# EAGLE design Power PCB (EAGLE 9.6.2)
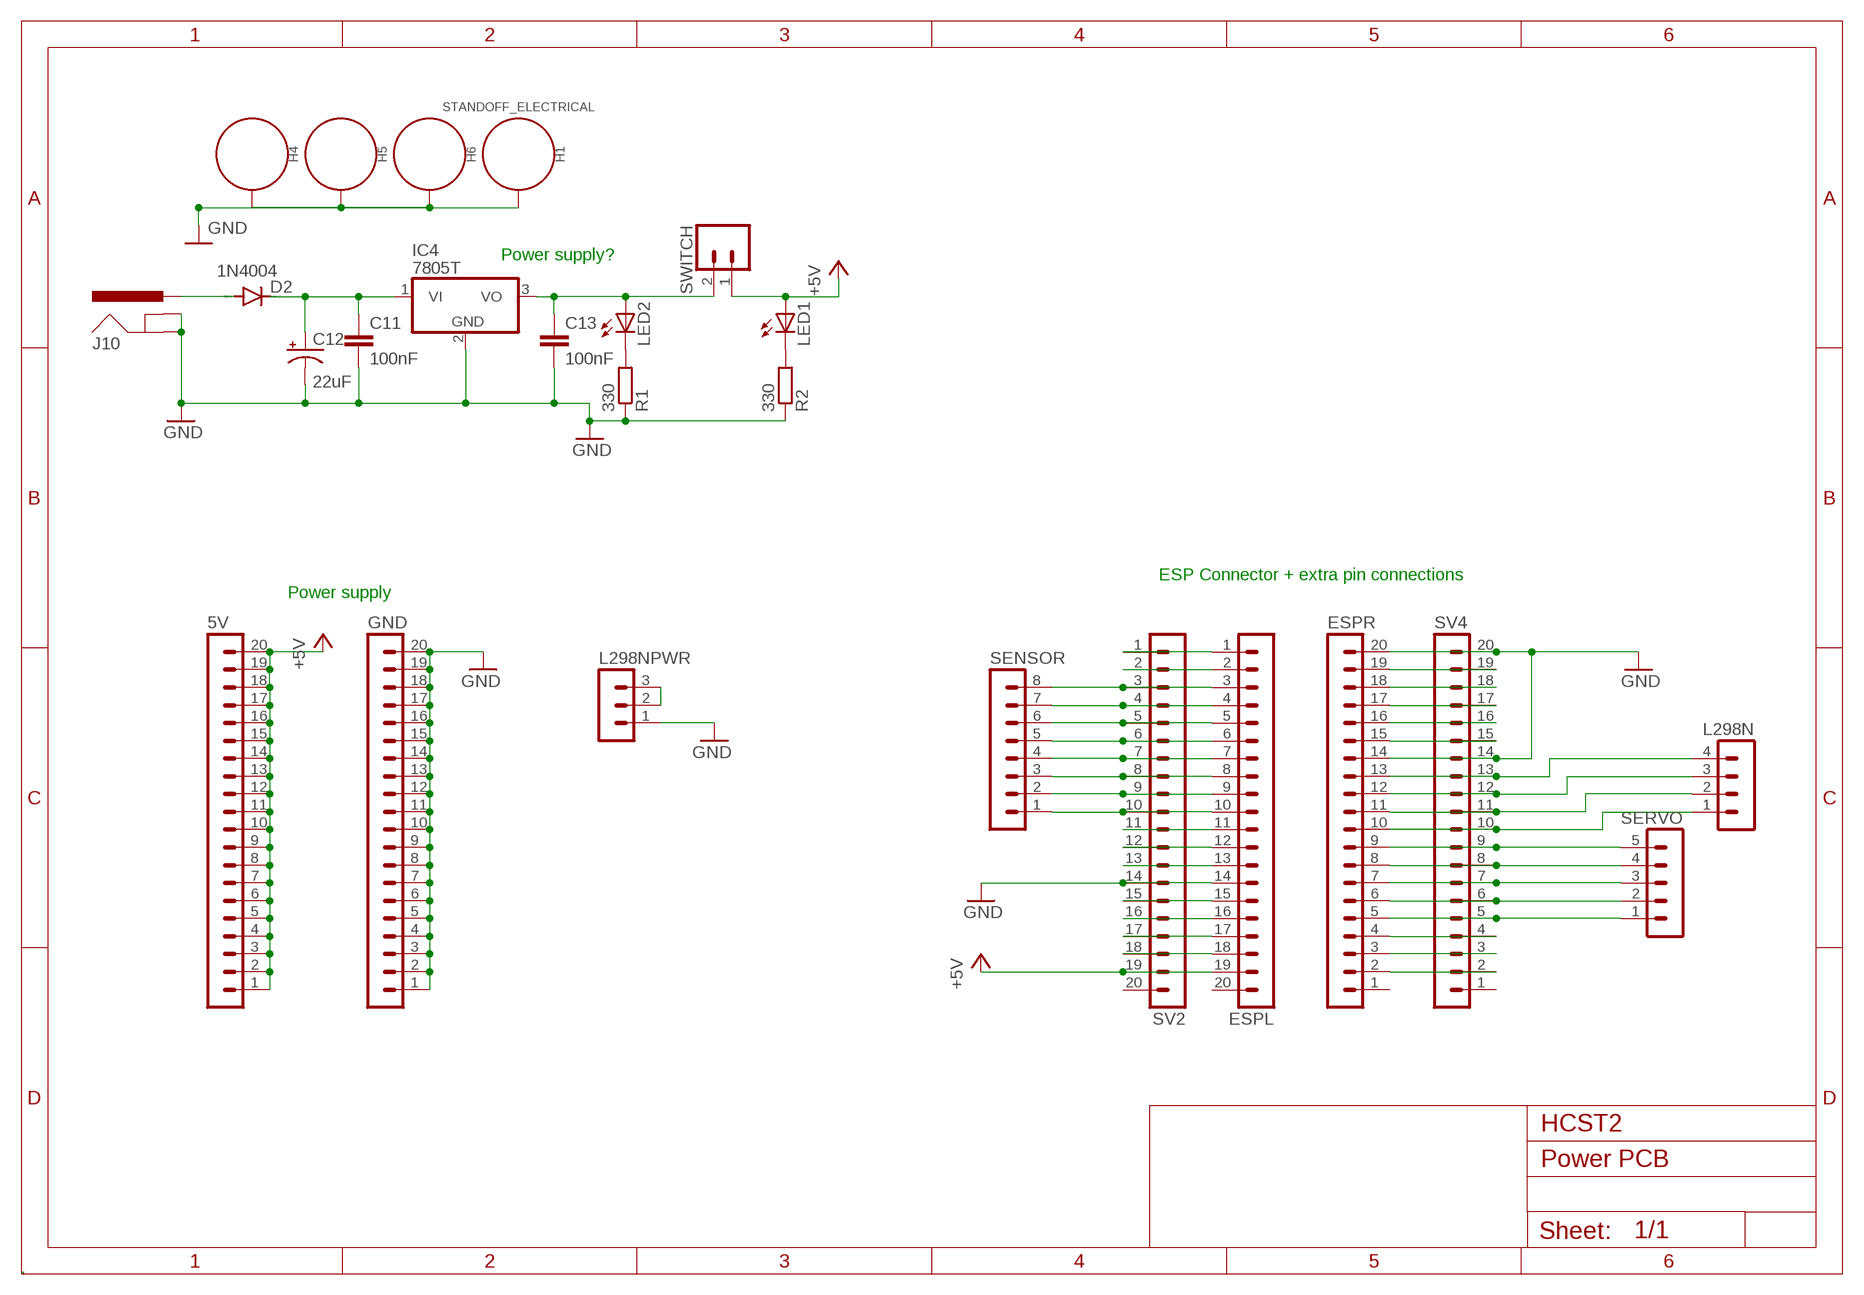
[diagram p0: schematic, sheet 1]

## Parts
5V  MA20-1  [MA20-1]
C11  100nF  C2.5/2  [C2.5-2]
C12  22uF  CPOL-USE2.5-7  [E2,5-7]
C13  100nF  C2.5/2  [C2.5-2]
D2  1N4004  [DO41-10]
ESPL  MA20-1  [MA20-1]
ESPR  MA20-1  [MA20-1]
GND  MA20-1  [MA20-1]
H1  STANDOFF_ELECTRICAL  [STANDOFF-ELECTRICAL]
H4  STANDOFF_ELECTRICAL  [STANDOFF-ELECTRICAL]
H5  STANDOFF_ELECTRICAL  [STANDOFF-ELECTRICAL]
H6  STANDOFF_ELECTRICAL  [STANDOFF-ELECTRICAL]
IC4  7805T  [TO220H]
J10  EL311-ROBOT_SPARKFUN-CONNECTORS_POWER_JACKPTH  [EL311-ROBOT_SPARKFUN-CONNECTORS_POWER_JACK_PTH]
L298N  MA04-1  [MA04-1]
L298NPWR  MA03-1  [MA03-1]
LED1  LED3MM  [LED3MM]
LED2  LED3MM  [LED3MM]
R1  330  R-EU_0207/10  [0207/10]
R2  330  R-EU_0207/10  [0207/10]
SENSOR  MA08-1  [MA08-1]
SERVO  MA05-1  [MA05-1]
SV2  MA20-1  [MA20-1]
SV4  MA20-1  [MA20-1]
SWITCH  CONN_02  [1X02]

## Nets
+5V [power]: 5V.1 5V.2 5V.3 5V.4 5V.5 5V.6 5V.7 5V.8 5V.9 5V.10 5V.11 5V.12 5V.13 5V.14 5V.15 5V.16 5V.17 5V.18 5V.19 5V.20 ESPL.19 LED1.A SV2.19 SWITCH.1
GND [power]: C11.2 C12.- C13.2 ESPL.14 ESPR.14 ESPR.20 GND.1 GND.2 GND.3 GND.4 GND.5 GND.6 GND.7 GND.8 GND.9 GND.10 GND.11 GND.12 GND.13 GND.14 GND.15 GND.16 GND.17 GND.18 GND.19 GND.20 H1.P1 H4.P1 H5.P1 H6.P1 IC4.2(GND) J10.GND J10.GNDBREAK L298NPWR.1 R1.1 R2.1 SV2.14 SV4.14 SV4.20
N$1: ESPR.10 L298N.1 SV4.10
N$2: ESPR.9 SERVO.5 SV4.9
N$3: ESPR.8 SERVO.4 SV4.8
N$4: ESPR.7 SERVO.3 SV4.7
N$5: ESPR.6 SERVO.2 SV4.6
N$6: ESPR.5 SERVO.1 SV4.5
N$7: ESPR.11 L298N.2 SV4.11
N$8: ESPR.12 L298N.3 SV4.12
N$9: ESPR.13 L298N.4 SV4.13
N$10: ESPR.19 SV4.19
N$11: ESPR.18 SV4.18
N$12: ESPR.17 SV4.17
N$13: ESPR.16 SV4.16
N$14: ESPR.15 SV4.15
N$15: ESPR.4 SV4.4
N$16: ESPR.3 SV4.3
N$17: ESPR.2 SV4.2
N$18: ESPL.18 SV2.18
N$19: ESPL.17 SV2.17
N$20: ESPL.16 SV2.16
N$21: ESPL.15 SV2.15
N$22: ESPL.13 SV2.13
N$23: ESPL.12 SV2.12
N$24: ESPL.11 SV2.11
N$25: ESPL.10 SENSOR.1 SV2.10
N$26: ESPL.9 SENSOR.2 SV2.9
N$27: ESPL.8 SENSOR.3 SV2.8
N$28: ESPL.7 SENSOR.4 SV2.7
N$29: ESPL.1 SV2.1
N$30: ESPL.2 SV2.2
N$31: ESPL.3 SENSOR.8 SV2.3
N$32: ESPL.4 SENSOR.7 SV2.4
N$33: ESPL.5 SENSOR.6 SV2.5
N$34: ESPL.6 SENSOR.5 SV2.6
N$35 [power]: C13.1 IC4.3(VO) LED2.A SWITCH.2
N$36 [power]: L298NPWR.2 L298NPWR.3
N$38: LED2.K(C) R1.2
N$39: LED1.K(C) R2.2
PWR3 [power]: D2.A J10.PWR
PWR4 [power]: C11.1 C12.+ D2.C IC4.1(VI)
Unconnected: ESPL.20 ESPR.1 SV2.20 SV4.1

## Notes on the sheet
- Power supply?
- ESP Connector + extra pin connections
- Power supply
- HCST2
- .

## Library data of the parts
5V ESPL ESPR GND SV2 SV4 = con-lstb:MA20-1: PIN HEADER; OC_FARNELL: unknown; OC_NEWARK: unknown
C11 C13 = capacitor-wima:C: CAPACITOR naming: grid - package width
C12 = adafruit:CPOL-US: POLARIZED CAPACITOR, American symbol
D2 = diode:1N4004: DIODE general purpose rectifier, 1 A
H1 = EL311 2021:STANDOFF_ELECTRICAL: Stand Off Drill holes with an electrical connection. For example, use these to ground your board to a chassis. Example SparkFun Products Screw - Phillips Head (1/4", 4-40, 10 pack) <https://www.sparkfun.com/products/10453> (PRT-10453) Screw - Phillips Head (1/2", 4-40, 10 pack) <https://www.sparkfun.com/products/10452> (PRT-10452) Screw - Phillips Head (3/4", 4-40, 10 pack) <https://www.sparkfun.com/products/10451> (PRT-10451) Screw - Phillips Head (1", 4-40, 10 pack) <https://www.sparkfun.com/products/10450> (PRT-10450)
H4-H6 = SparkFun-Hardware:STANDOFF_ELECTRICAL: Stand Off Drill holes with an electrical connection. For example, use these to ground your board to a chassis. Example SparkFun Products Screw - Phillips Head (1/4", 4-40, 10 pack) <https://www.sparkfun.com/products/10453> (PRT-10453) Screw - Phillips Head (1/2", 4-40, 10 pack) <https://www.sparkfun.com/products/10452> (PRT-10452) Screw - Phillips Head (3/4", 4-40, 10 pack) <https://www.sparkfun.com/products/10451> (PRT-10451) Screw - Phillips Head (1", 4-40, 10 pack) <https://www.sparkfun.com/products/10450> (PRT-10450)
IC4 = adafruit:78*: Positive VOLTAGE REGULATOR Added bigger pads to the TO-92 package
J10 = EL311_2017_18:EL311-ROBOT_SPARKFUN-CONNECTORS_POWER_JACK: Power Jack This is the standard 5.5mm barrel jack for power. The PTH is the most common, proven, reliable, footprint. The Slot footprint only works if the mill layer is transmitted to the PCB fab house so be warned. Mating wall wart : TOL-00298 (and others); PROD_ID: PRT-00119
L298N = con-lstb:MA04-1: PIN HEADER; OC_FARNELL: unknown; OC_NEWARK: unknown
L298NPWR = con-lstb:MA03-1: PIN HEADER; OC_FARNELL: unknown; OC_NEWARK: unknown
LED1 LED2 = EL311 2021:LED: LED OSRAM: - CHIPLED LG R971, LG N971, LY N971, LG Q971, LY Q971, LO R971, LY R971 LH N974, LH R974 LS Q976, LO Q976, LY Q976 LO Q996 - Hyper CHIPLED LW Q18S LB Q993, LB Q99A, LB R99A - SideLED LS A670, LO A670, LY A670, LG A670, LP A670 LB A673, LV A673, LT A673, LW A673 LH A674 LY A675 LS A676, LA A676, LO A676, LY A676, LW A676 LS A679, LY A679, LG A679 - Hyper Micro SIDELED® LS Y876, LA Y876, LO Y876, LY Y876 LT Y87S - SmartLED LW L88C, LW L88S LB L89C, LB L89S, LG L890 LS L89K, LO L89K, LY L89K LS L896, LA L896, LO L896, LY L896 - TOPLED LS T670, LO T670, LY T670, LG T670, LP T670 LSG T670, LSP T670, LSY T670, LOP T670, LYG T670 LG T671, LOG T671, LSG T671 LB T673, LV T673, LT T673, LW T673 LH T674 LS T676, LA T676, LO T676, LY T676, LB T676, LH T676, LSB T676, LW T676 LB T67C, LV T67C, LT T67C, LS T67K, LO T67K, LY T67K, LW E67C LS E67B, LA E67B, LO E67B, LY E67B, LB E67C, LV E67C, LT E67C LW T67C LS T679, LY T679, LG T679 LS T770, LO T770, LY T770, LG T770, LP T770 LB T773, LV T773, LT T773, LW T773 LH T774 LS E675, LA E675, LY E675, LS T675 LS T776, LA T776, LO T776, LY T776, LB T776 LHGB T686 LT T68C, LB T68C - Hyper Mini TOPLED® LB M676 - Mini TOPLED Santana® LG M470 LS M47K, LO M47K, LY M47K Source: http://www.osram.convergy.de/
R1 R2 = EL311 2021:R-EU_: RESISTOR, European symbol
SENSOR = con-lstb:MA08-1: PIN HEADER; OC_FARNELL: unknown; OC_NEWARK: unknown
SERVO = con-lstb:MA05-1: PIN HEADER; OC_FARNELL: unknown; OC_NEWARK: unknown
SWITCH = EL311 2021:CONN_02: Multi connection point. Often used as Generic Header-pin footprint for 0.1 inch spaced/style header connections On any of the 0.1 inch spaced packages, you can populate with these: Break Away Headers - Straight <https://www.sparkfun.com/products/116> (PRT-00116) Break Away Male Headers - Right Angle <https://www.sparkfun.com/products/553> (PRT-00553) Female Headers <https://www.sparkfun.com/products/115> (PRT-00115) Break Away Headers - Machine Pin <https://www.sparkfun.com/products/117> (PRT-00117) Break Away Female Headers - Swiss Machine Pin <https://www.sparkfun.com/products/743> (PRT-00743) For SCREWTERMINALS and SPRING TERMINALS visit here: Screw Terimnals on SparkFun.com <https://www.sparkfun.com/search/results?term=Screw+Terminals> (5mm/3.5mm/2.54mm spacing) This device is also useful as a general connection point to wire up your design to another part of your project. Our various solder wires solder well into these plated through hole pads. Hook-Up Wire - Assortment (Stranded, 22 AWG) <https://www.sparkfun.com/products/11375> (PRT-11375) Hook-Up Wire - Assortment (Solid Core, 22 AWG) <https://www.sparkfun.com/products/11367> (PRT-11367) View the entire wire category on our website here <https://www.sparkfun.com/categories/141> Special notes: Molex polarized connector foot print use with: PRT-08233 with associated crimp pins and housings. 2.54_SCREWTERM for use with PRT-10571. 3.5mm Screw Terminal footprints for PRT-08084 5mm Screw Terminal footprints for use with PRT-08432; PROD_ID: CONN-13512; SF_ID: PRT-09918; SF_SKU: PRT-08432; SKU: PRT-09914

## Net classes
0 default: width 0.406 mm, drill 0.406 mm, clearance 0.406 mm
1 power: width 0.635 mm, drill 0.406 mm, clearance 0.406 mm
2 Power2: width 1.397 mm, drill 0.406 mm, clearance 0.406 mm

## Board
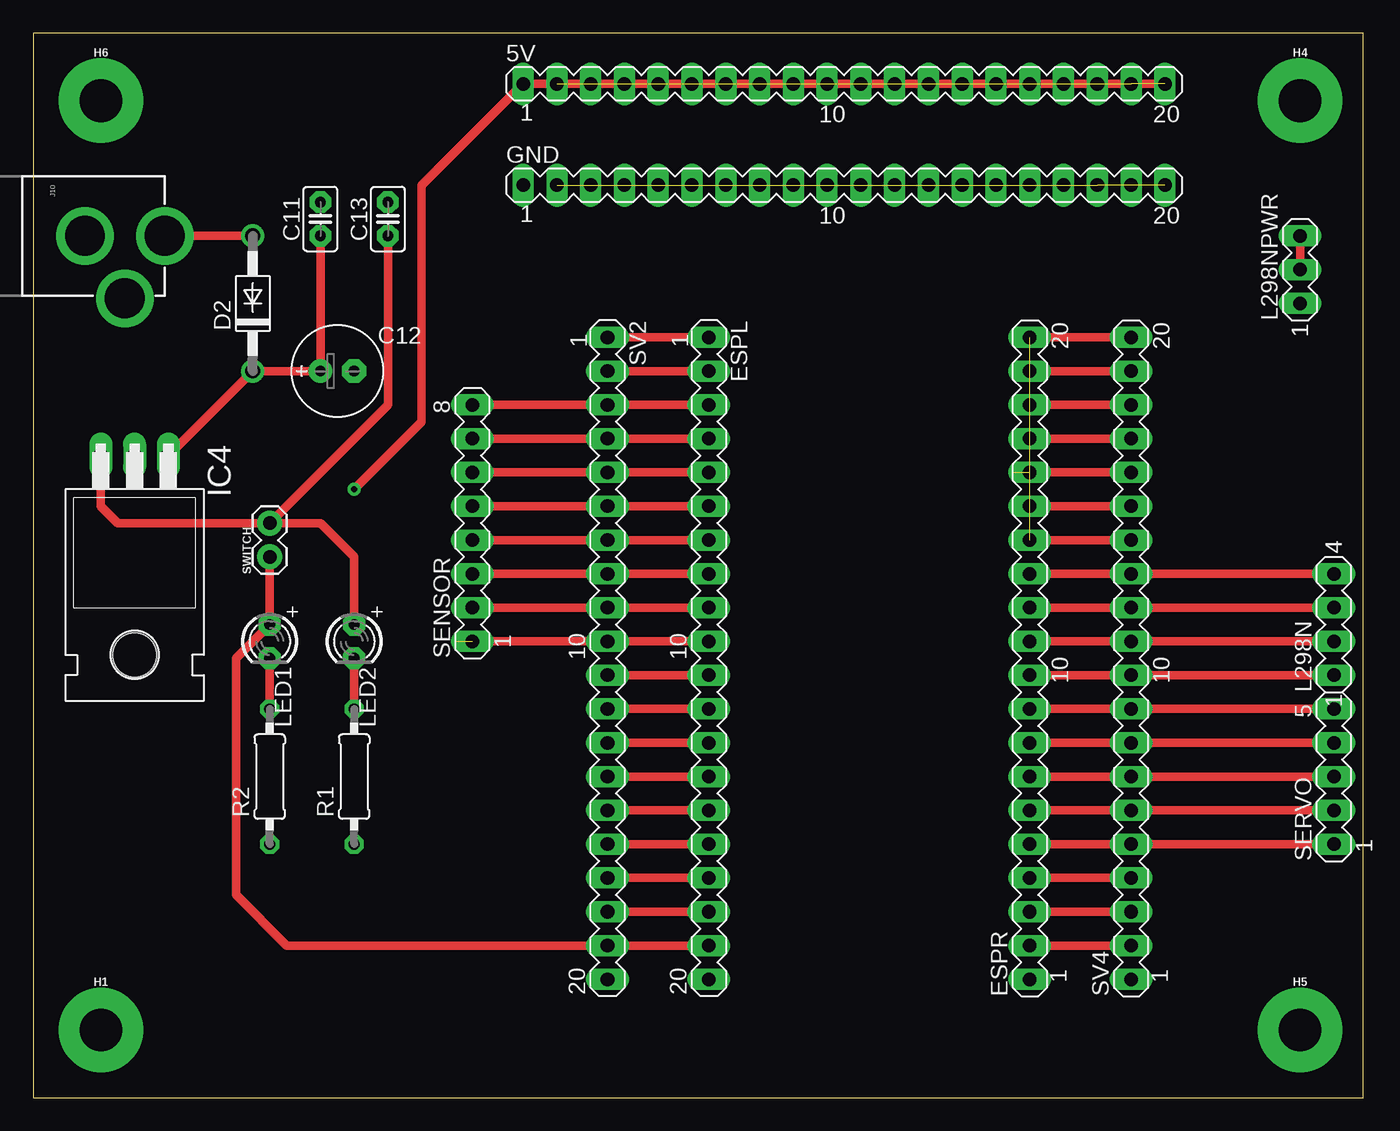
[diagram p1: board, top side]
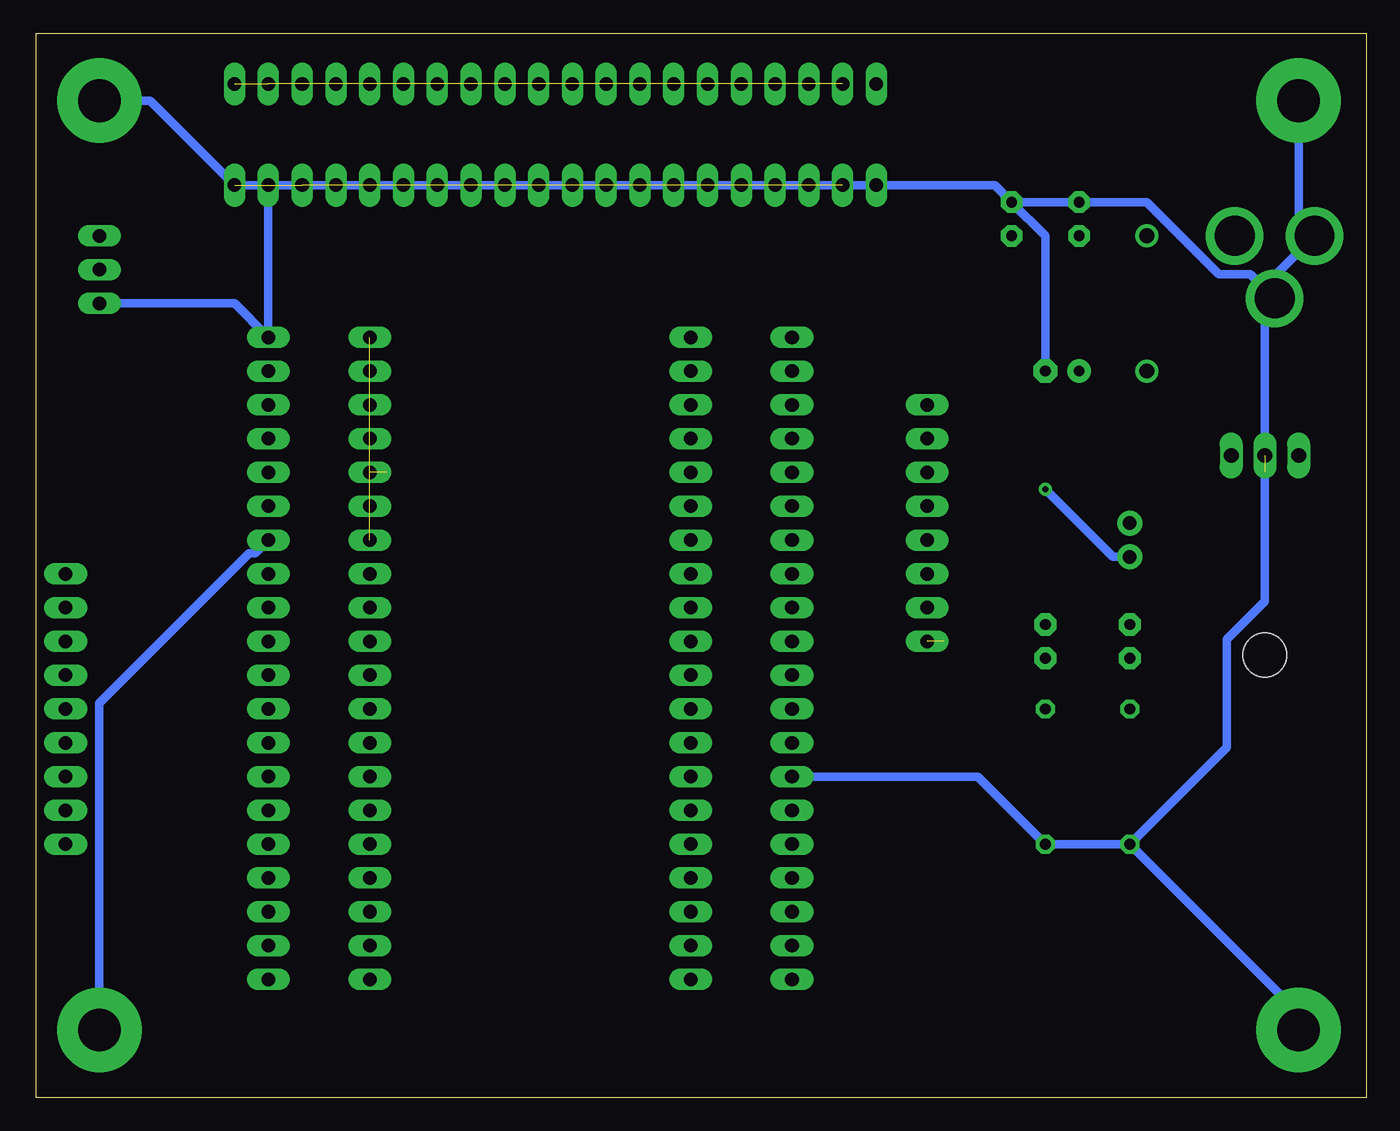
[diagram p2: board, bottom side, seen from below]

Size 100 x 80 mm. Coordinates in mm from the lower left corner, seen from the top.
Outline: 0,0 100,0 100,80 0,80 0,0
Copper layers (1*16): Top 0.035mm / dielectric 1.5mm / Bottom 0.035mm
Design rules "EL311_DRC_2020": minimum track width 12mil, minimum drill 18mil, track to track 12mil, track to pad 12mil, pad to pad 12mil, via to via 12mil, smd to smd 12mil, copper to edge 12mil, drill to drill 15mil, minimum pad ring 12mil, minimum via ring 10mil, stop-mask expansion 4mil, vias tented up to drill 25mil, thermal gap 10mil

### Footprints (pad centres in the part's own frame; a part is rotated, then mirrored left to right if it is on the bottom)
MA20-1 = drill 1.016 long: 1 -24.13,0; 2 -21.59,0; 3 -19.05,0; 4 -16.51,0; 5 -13.97,0; 6 -11.43,0; 7 -8.89,0; 8 -6.35,0; 9 -3.81,0; 10 -1.27,0; 11 1.27,0; 12 3.81,0; 13 6.35,0; 14 8.89,0; 15 11.43,0; 16 13.97,0; 17 16.51,0; 18 19.05,0; 19 21.59,0; 20 24.13,0
C2.5-2 = drill 0.813 pad 1.6 octagon: 1 -1.27,0; 2 1.27,0
E2,5-7 = drill 0.813 pad 1.778: + -1.27,0 | drill 0.813 pad 1.778 octagon: - 1.27,0
DO41-10 = drill 1.118: A 5.08,0; C -5.08,0
STANDOFF-ELECTRICAL = drill 3.2 pad 6.35: P1 0,0
TO220H = drill 1.118 long: 1 -2.54,-10.16; 2 0,-10.16; 3 2.54,-10.16 | hole 3.302: 0,4.826
EL311-ROBOT_SPARKFUN-CONNECTORS_POWER_JACK_PTH = drill 2.997 pad 4.318: GND 0,7.7; GNDBREAK 4.7,10.7; PWR 0,13.7
MA04-1 = drill 1.016 long: 1 -3.81,0; 2 -1.27,0; 3 1.27,0; 4 3.81,0
MA03-1 = drill 1.016 long: 1 -2.54,0; 2 0,0; 3 2.54,0
LED3MM = drill 0.813 pad 1.676 octagon: A -1.27,0; K 1.27,0
0207/10 = drill 0.813 octagon: 1 -5.08,0; 2 5.08,0
MA08-1 = drill 1.016 long: 1 -8.89,0; 2 -6.35,0; 3 -3.81,0; 4 -1.27,0; 5 1.27,0; 6 3.81,0; 7 6.35,0; 8 8.89,0
MA05-1 = drill 1.016 long: 1 -5.08,0; 2 -2.54,0; 3 0,0; 4 2.54,0; 5 5.08,0
1X02 = drill 1.016 pad 1.88: 1 0,0; 2 2.54,0

### Placement (x,y rotation side)
5V  60.96,76.2 0 top
C11  21.59,66.04 90 top
C12  22.86,54.61 0 top
C13  26.67,66.04 90 top
D2  16.51,59.69 90 top
ESPL  50.8,33.02 270 top
ESPR  74.93,33.02 90 top
GND  60.96,68.58 0 top
H1  5.08,5.08 0 top
H4  95.25,74.93 0 top
H5  95.25,5.08 0 top
H6  5.08,74.93 0 top
IC4  7.62,38.1 180 top
J10  -3.81,64.77 270 top
L298N  97.79,35.56 90 top
L298NPWR  95.25,62.23 90 top
LED1  17.78,34.29 270 top
LED2  24.13,34.29 270 top
R1  24.13,24.13 90 top
R2  17.78,24.13 90 top
SENSOR  33.02,43.18 90 top
SERVO  97.79,24.13 90 top
SV2  43.18,33.02 270 top
SV4  82.55,33.02 90 top
SWITCH  17.78,40.64 90 top

### Tracks (layer width: path | path; a pad name or v marks a point on that pad's centre or on a via)
+5V  (via drill 0.46)  (18 unrouted)
  Top 0.635: ESPL.19 SV2.19 19.05,11.43 15.24,15.24 15.24,33.02 LED1.A SWITCH.1 | 5V.20 5V.1 29.21,68.58 29.21,50.8 v24.13,45.72
  Bottom 0.635: v24.13,45.72 19.05,40.64 SWITCH.1
GND  (20 unrouted)
  Top 0.635: L298NPWR.1 93.98,59.69 | ESPR.20 SV4.20 | SV4.14 ESPR.14 | SV2.14 ESPL.14
  Bottom 0.635: C13.2 C11.2 16.51,67.31 11.08,61.89 8.71,61.89 J10.GNDBREAK | C13.2 27.94,68.58 GND.1 GND.20 91.44,74.93 H4.P1 | GND.19 SV4.20 85.09,59.69 L298NPWR.1 | R2.1 R1.1 29.21,24.13 SV2.14 | R2.1 5.08,6.35 H1.P1 | H6.P1 5.08,65.96 J10.GND 6.89,61.77 J10.GNDBREAK | J10.GNDBREAK 7.62,59.34 7.62,46.99 | IC4.2 7.62,37.31 10.48,34.46 10.48,26.35 R2.1 | C13.2 24.13,64.77 C12.- | SV4.14 83.55,40.91 84,40.91 95.25,29.66 H5.P1
N$1
  Top 0.635: ESPR.10 81.28,31.75 SV4.10 L298N.1
N$2
  Top 0.635: ESPR.9 SV4.9 SERVO.5
N$3
  Top 0.635: ESPR.8 SV4.8 SERVO.4
N$4
  Top 0.635: ESPR.7 SV4.7 SERVO.3
N$5
  Top 0.635: ESPR.6 SV4.6 SERVO.2
N$6
  Top 0.635: ESPR.5 SV4.5 SERVO.1
N$7
  Top 0.635: ESPR.11 SV4.11 L298N.2
N$8
  Top 0.635: ESPR.12 SV4.12 L298N.3
N$9
  Top 0.635: ESPR.13 SV4.13 L298N.4
N$10
  Top 0.635: ESPR.19 SV4.19
N$11
  Top 0.635: ESPR.18 SV4.18
N$12
  Top 0.635: ESPR.17 SV4.17
N$13  (1 unrouted)
  Top 0.635: SV4.16 73.66,46.99
N$14
  Top 0.635: ESPR.15 SV4.15
N$15
  Top 0.635: SV4.4 ESPR.4
N$16
  Top 0.635: ESPR.3 SV4.3
N$17
  Top 0.635: ESPR.2 SV4.2
N$18
  Top 0.635: SV2.18 ESPL.18
N$19
  Top 0.635: ESPL.17 SV2.17
N$20
  Top 0.635: SV2.16 ESPL.16
N$21
  Top 0.635: ESPL.15 SV2.15
N$22
  Top 0.635: ESPL.13 SV2.13
N$23
  Top 0.635: SV2.12 ESPL.12
N$24
  Top 0.635: ESPL.11 SV2.11
N$25  (1 unrouted)
  Top 0.635: ESPL.10 SV2.10 31.75,34.29
N$26
  Top 0.635: ESPL.9 SV2.9 SENSOR.2
N$27
  Top 0.635: ESPL.8 SV2.8 SENSOR.3
N$28
  Top 0.635: ESPL.7 SV2.7 SENSOR.4
N$29
  Top 0.635: ESPL.1 SV2.1
N$30
  Top 0.635: SV2.2 ESPL.2
N$31
  Top 0.635: ESPL.3 SV2.3 SENSOR.8
N$32
  Top 0.635: ESPL.4 SV2.4 SENSOR.7
N$33
  Top 0.635: ESPL.5 SV2.5 SENSOR.6
N$34
  Top 0.635: ESPL.6 SV2.6 SENSOR.5
N$35
  Top 0.635: SWITCH.2 21.59,43.18 24.13,40.64 LED2.A | IC4.3 5.08,44.45 6.35,43.18 SWITCH.2 | C13.1 26.67,52.07 SWITCH.2
N$36
  Top 0.635: L298NPWR.2 L298NPWR.3
N$38
  Top 0.635: LED2.K R1.2
N$39
  Top 0.635: LED1.K R2.2
PWR3
  Top 0.635: J10.PWR D2.A
PWR4
  Top 0.635: IC4.1 D2.C C12.+ C11.1